# Altium schematic sheet Sheet1.SchDoc
size 594 x 420 mm; Address1: Address1; Address2: Address2; Address3: Address3; Address4: Address4; SheetNumber: 1; SheetTotal: 1
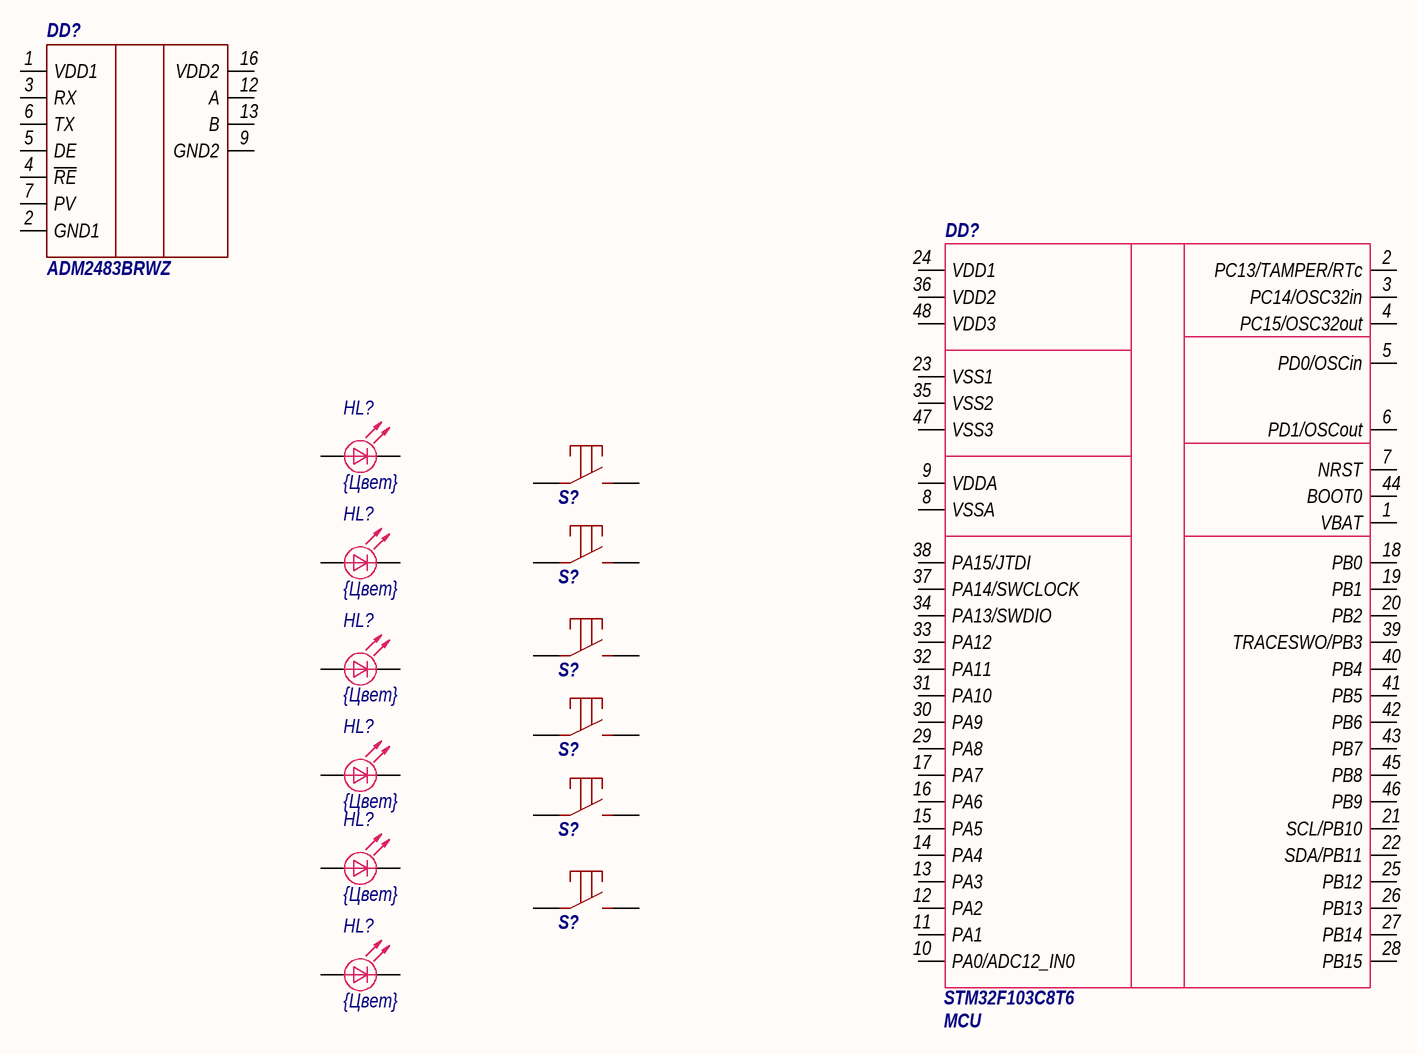
[diagram p0: Sheet1.SchDoc]

## Parts
(Parts that share a designator on the sheet are numbered #1, #2 ... from top to bottom, then left to right.)
DD?#1  ADM2483BRWZ  [SOIC-16W]
DD?#2  STM32F103C8T6  Value1: MCU  [LQFP48]
HL?#1  Color: {Цвет}  [0805D]  (hidden comment: LED)
HL?#2  Color: {Цвет}  [0805D]  (hidden comment: LED)
HL?#3  Color: {Цвет}  [0805D]  (hidden comment: LED)
HL?#4  Color: {Цвет}  [0805D]  (hidden comment: LED)
HL?#5  Color: {Цвет}  [0805D]  (hidden comment: LED)
HL?#6  Color: {Цвет}  [0805D]  (hidden comment: LED)
S?#1  Button_DIP_12x12  [Button_DIP_12x12]  (value not drawn)
S?#2  Button_DIP_12x12  [Button_DIP_12x12]  (value not drawn)
S?#3  Button_DIP_12x12  [Button_DIP_12x12]  (value not drawn)
S?#4  Button_DIP_12x12  [Button_DIP_12x12]  (value not drawn)
S?#5  Button_DIP_12x12  [Button_DIP_12x12]  (value not drawn)
S?#6  Button_DIP_12x12  [Button_DIP_12x12]  (value not drawn)

## Nets

Not connected (* = marked no-connect by the designer): DD?#1 1(VDD1) 2(GND1) 3(RX) 4(~{RE}) 5(DE) 6(TX) 7(PV) 9(GND2) 12(A) 13(B) 16(VDD2); DD?#2 1(VBAT) 2(PC13/TAMPER/RTc) 3(PC14/OSC32in) 4(PC15/OSC32out) 5(PD0/OSCin) 6(PD1/OSCout) 7(NRST) 8(VSSA) 9(VDDA) 10(PA0/ADC12_IN0) 11(PA1) 12(PA2) 13(PA3) 14(PA4) 15(PA5) 16(PA6) 17(PA7) 18(PB0) 19(PB1) 20(PB2) 21(SCL/PB10) 22(SDA/PB11) 23(VSS1) 24(VDD1) 25(PB12) 26(PB13) 27(PB14) 28(PB15) 29(PA8) 30(PA9) 31(PA10) 32(PA11) 33(PA12) 34(PA13/SWDIO) 35(VSS2) 36(VDD2) 37(PA14/SWCLOCK) 38(PA15/JTDI) 39(TRACESWO/PB3) 40(PB4) 41(PB5) 42(PB6) 43(PB7) 44(BOOT0) 45(PB8) 46(PB9) 47(VSS3) 48(VDD3); HL?#1 1 2; HL?#2 1 2; HL?#3 1 2; HL?#4 1 2; HL?#5 1 2; HL?#6 1 2; S?#1 1 2; S?#2 1 2; S?#3 1 2; S?#4 1 2; S?#5 1 2; S?#6 1 2

## Notes on the sheet
- Перв. примен.
- Справ. №
- Подп. и дата
- Инв. № дубл.
- Взам. инв. №
- Разраб.
- Изм.
- Лист
- № докум.
- Подп.
- Дата
- Лит.
- Масса
- Масштаб
- Пров.
- Т.контр.
- Схема электрическая принципиальная
- Листов
- Инв. № подл.
- Утв.
- Н.контр.
- Копировал
- Формат А2

## Library data of the parts
DD?#1 = ADM2483BRWZ: Прием передатчик RS485 с гальванической развязкой; Part Number: ADM2483BRWZ
DD?#2 = STM32F103C8T6: Микроконтроллер; Manufacturer: ST Microelectronics; Rate: -0,3...4,0В; Shop: магазин с самой дешевой ценой; Notice: 48 пиновая версия STM32F103; Datasheet: http://www.st.com/content/ccc/resource/technical/document/datasheet/33/d4/6f/1d/df/0b/4c/6d/CD00161566.pdf/files/CD00161566.pdf/jcr:content/translations/en.CD00161566.pdf; Case: корпус; Part Number: STM32F103C8T6
HL?#1-HL?#6 = LED: Светодиод; Part Number: LED
S?#1-S?#6 = Button_DIP_12x12: Тактовая кнопка, DIP 12 x 12 мм; Part Number: Button_DIP_12x12